# Altium schematic sheet CM5_HighSpeed.SchDoc
size 297 x 209 mm
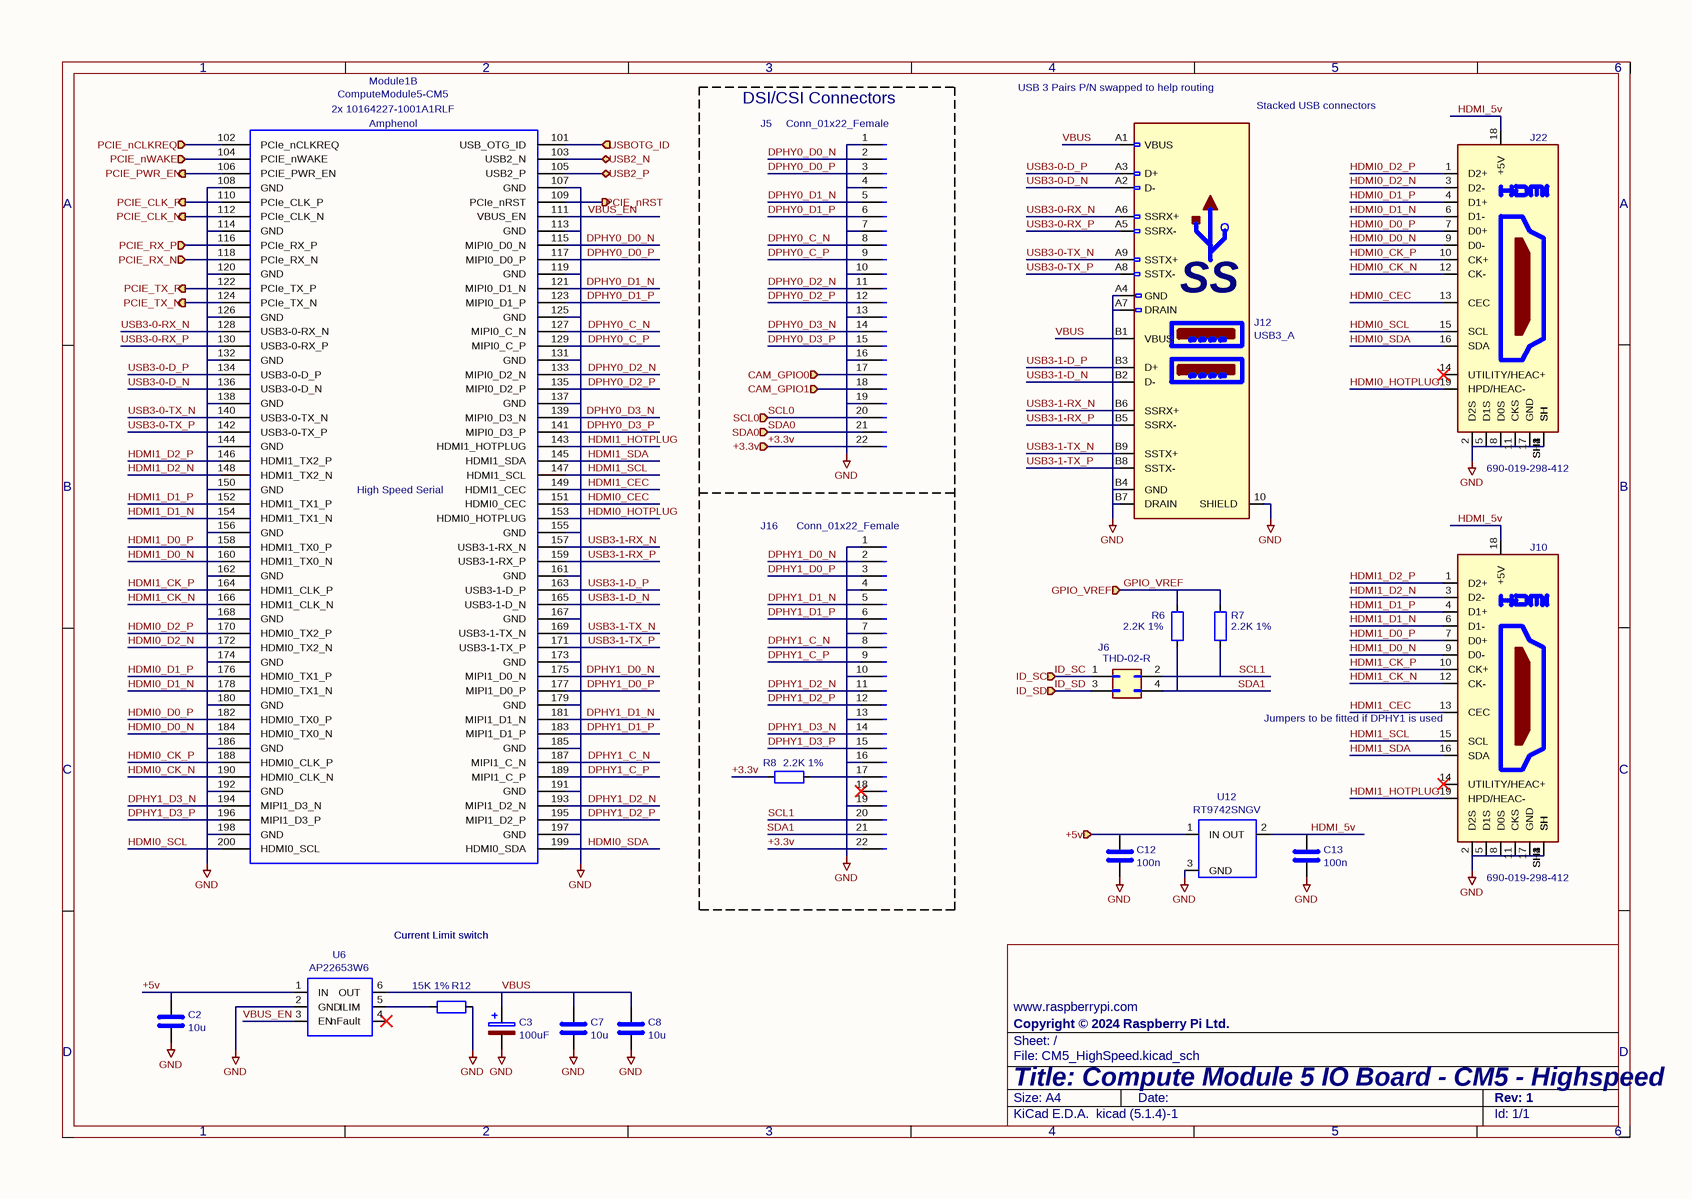
[diagram p0: CM5_HighSpeed.SchDoc]

## Parts
C2  10u  [C_0805_2012Metric]
C3  100uF  [CP_EIA-7343-31_Kemet-D]
C7  10u  [C_0805_2012Metric]
C8  10u  [C_0805_2012Metric]
C12  100n  [C_0402_1005Metric]
C13  100n  [C_0402_1005Metric]
J5  Conn_01x22_Female  [Hirose_FH12-22S-0.5SH_1x22-1MP_P0.50mm_Horizontal]
J6  THD-02-R  [PinHeader_2x02_P2.54mm_Vertical]
J10  690-019-298-412  [EDAC 690-019-298-412]
J12  USB3_A  [MTCONN_UBAF30-D2011]
J16  Conn_01x22_Female  [Hirose_FH12-22S-0.5SH_1x22-1MP_P0.50mm_Horizontal]
J22  690-019-298-412  [EDAC 690-019-298-412]
Module1  Field4: Amphenol  Field5: 2x 10164227-1001A1RLF  [Raspberry-Pi-5-Compute-Module]  (hidden comment: ComputeModule5-CM5)  (part B of 2)
R6  2.2K 1%  [R_0402_1005Metric]
R7  2.2K 1%  [R_0402_1005Metric]
R8  2.2K 1%  [R_0402_1005Metric]
R12  15K 1%  [R_0402_1005Metric]
U6  AP22653W6  [SOT-23-6]
U12  RT9742SNGV  [TSOT-23_HandSoldering]

## Ports
+3.3v (in), +5v (in), CAM_GPIO0 (in), CAM_GPIO1 (in), GPIO_VREF (in), ID_SC (in), ID_SD (in), PCIE_CLK_N (out), PCIE_CLK_P (out), PCIE_nCLKREQ (in), PCIE_nRST (out), PCIE_nWAKE (in), PCIE_PWR_EN (out), PCIE_RX_N (in), PCIE_RX_P (in), PCIE_TX_N (out), PCIE_TX_P (out), SCL0 (in), SDA0 (in), USB2_N (bidir), USB2_P (bidir), USBOTG_ID (in)

## Nets
DPHY1_C_N: C2.2 C3.2 C7.2 C8.2 C12.2 C13.2 J5.1(Pin_1) J5.4(Pin_4) J5.7(Pin_7) J5.10(Pin_10) J5.13(Pin_13) J5.16(Pin_16) J5.19(Pin_19) J10.2(D2S) J10.5(D1S) J10.8(D0S) J10.11(CKS) J10.17(GND) J10.SH1(SH) J10.SH2(SH) J10.SH3(SH) J10.SH4(SH) J12.10(SHIELD) J12.A4(GND) J12.A7(DRAIN) J12.B4(GND) J12.B7(DRAIN) J16.1(Pin_1) J16.4(Pin_4) J16.7(Pin_7) J16.8(Pin_8) J16.10(Pin_10) J16.13(Pin_13) J16.16(Pin_16) J16.19(Pin_19) J22.2(D2S) J22.5(D1S) J22.8(D0S) J22.11(CKS) J22.17(GND) J22.SH1(SH) J22.SH2(SH) J22.SH3(SH) J22.SH4(SH) Module1.107(GND) Module1.108(GND) Module1.113(GND) Module1.114(GND) Module1.119(GND) Module1.120(GND) Module1.125(GND) Module1.126(GND) Module1.131(GND) Module1.132(GND) Module1.137(GND) Module1.138(GND) Module1.144(GND) Module1.150(GND) Module1.155(GND) Module1.156(GND) Module1.161(GND) Module1.162(GND) Module1.167(GND) Module1.168(GND) Module1.173(GND) Module1.174(GND) Module1.179(GND) Module1.180(GND) Module1.185(GND) Module1.186(GND) Module1.187(MIPI1_C_N) Module1.191(GND) Module1.192(GND) Module1.197(GND) Module1.198(GND) R12.2 U6.2(GND) U12.3(GND)  [also labelled GND]
+3.3v: J5.22(Pin_22) J16.22(Pin_22) R8.1 ; port +3.3v
+5v: C12.1 U12.1(IN) ; port +5v
+5v: C2.1 U6.1(IN)  [a separate net that carries the same name]
CAM_GPIO0: J5.17(Pin_17) ; port CAM_GPIO0
CAM_GPIO1: J5.18(Pin_18) ; port CAM_GPIO1
DPHY0_C_N: J5.8(Pin_8) Module1.127(MIPI0_C_N)
DPHY0_C_P: J5.9(Pin_9) Module1.129(MIPI0_C_P)
DPHY0_D0_N: J5.2(Pin_2) Module1.115(MIPI0_D0_N)
DPHY0_D0_P: J5.3(Pin_3) Module1.117(MIPI0_D0_P)
DPHY0_D1_N: J5.5(Pin_5) Module1.121(MIPI0_D1_N)
DPHY0_D1_P: J5.6(Pin_6) Module1.123(MIPI0_D1_P)
DPHY0_D2_N: J5.11(Pin_11) Module1.133(MIPI0_D2_N)
DPHY0_D2_P: J5.12(Pin_12) Module1.135(MIPI0_D2_P)
DPHY0_D3_N: J5.14(Pin_14) Module1.139(MIPI0_D3_N)
DPHY0_D3_P: J5.15(Pin_15) Module1.141(MIPI0_D3_P)
DPHY1_C_P: J16.9(Pin_9) Module1.189(MIPI1_C_P)
DPHY1_D0_N: J16.2(Pin_2) Module1.175(MIPI1_D0_N)
DPHY1_D0_P: J16.3(Pin_3) Module1.177(MIPI1_D0_P)
DPHY1_D1_N: J16.5(Pin_5) Module1.181(MIPI1_D1_N)
DPHY1_D1_P: J16.6(Pin_6) Module1.183(MIPI1_D1_P)
DPHY1_D2_N: J16.11(Pin_11) Module1.193(MIPI1_D2_N)
DPHY1_D2_P: J16.12(Pin_12) Module1.195(MIPI1_D2_P)
DPHY1_D3_N: J16.14(Pin_14) Module1.194(MIPI1_D3_N)
DPHY1_D3_P: J16.15(Pin_15) Module1.196(MIPI1_D3_P)
GPIO_VREF: R6.1 R7.1 ; port GPIO_VREF
HDMI0_CEC: J22.13(CEC) Module1.151(HDMI0_CEC)
HDMI0_CK_N: J22.12(CK-) Module1.190(HDMI0_CLK_N)
HDMI0_CK_P: J22.10(CK+) Module1.188(HDMI0_CLK_P)
HDMI0_D0_N: J22.9(D0-) Module1.184(HDMI0_TX0_N)
HDMI0_D0_P: J22.7(D0+) Module1.182(HDMI0_TX0_P)
HDMI0_D1_N: J22.6(D1-) Module1.178(HDMI0_TX1_N)
HDMI0_D1_P: J22.4(D1+) Module1.176(HDMI0_TX1_P)
HDMI0_D2_N: J22.3(D2-) Module1.172(HDMI0_TX2_N)
HDMI0_D2_P: J22.1(D2+) Module1.170(HDMI0_TX2_P)
HDMI0_HOTPLUG: J22.19(HPD/HEAC-) Module1.153(HDMI0_HOTPLUG)
HDMI0_SCL: J22.15(SCL) Module1.200(HDMI0_SCL)
HDMI0_SDA: J22.16(SDA) Module1.199(HDMI0_SDA)
HDMI1_CEC: J10.13(CEC) Module1.149(HDMI1_CEC)
HDMI1_CK_N: J10.12(CK-) Module1.166(HDMI1_CLK_N)
HDMI1_CK_P: J10.10(CK+) Module1.164(HDMI1_CLK_P)
HDMI1_D0_N: J10.9(D0-) Module1.160(HDMI1_TX0_N)
HDMI1_D0_P: J10.7(D0+) Module1.158(HDMI1_TX0_P)
HDMI1_D1_N: J10.6(D1-) Module1.154(HDMI1_TX1_N)
HDMI1_D1_P: J10.4(D1+) Module1.152(HDMI1_TX1_P)
HDMI1_D2_N: J10.3(D2-) Module1.148(HDMI1_TX2_N)
HDMI1_D2_P: J10.1(D2+) Module1.146(HDMI1_TX2_P)
HDMI1_HOTPLUG: J10.19(HPD/HEAC-) Module1.143(HDMI1_HOTPLUG)
HDMI1_SCL: J10.15(SCL) Module1.147(HDMI1_SCL)
HDMI1_SDA: J10.16(SDA) Module1.145(HDMI1_SDA)
HDMI_5v: C13.1 J10.18(+5V) J22.18(+5V) U12.2(OUT)
ID_SC: J6.1(Pin_1) ; port ID_SC
ID_SD: J6.3(Pin_3) ; port ID_SD
PCIE_CLK_N: Module1.112(PCIe_CLK_N) ; port PCIE_CLK_N
PCIE_CLK_P: Module1.110(PCIe_CLK_P) ; port PCIE_CLK_P
PCIE_nCLKREQ: Module1.102(PCIe_nCLKREQ) ; port PCIE_nCLKREQ
PCIE_nRST: Module1.109(PCIe_nRST) ; port PCIE_nRST
PCIE_nWAKE: Module1.104(PCIE_nWAKE) ; port PCIE_nWAKE
PCIE_PWR_EN: Module1.106(PCIE_PWR_EN) ; port PCIE_PWR_EN
PCIE_RX_N: Module1.118(PCIe_RX_N) ; port PCIE_RX_N
PCIE_RX_P: Module1.116(PCIe_RX_P) ; port PCIE_RX_P
PCIE_TX_N: Module1.124(PCIe_TX_N) ; port PCIE_TX_N
PCIE_TX_P: Module1.122(PCIe_TX_P) ; port PCIE_TX_P
SCL0: J5.20(Pin_20) ; port SCL0
SCL1: J6.2(Pin_2) J16.20(Pin_20) R7.2
SDA0: J5.21(Pin_21) ; port SDA0
SDA1: J6.4(Pin_4) J16.21(Pin_21) R6.2
USB2_N: Module1.103(USB2_N) ; port USB2_N
USB2_P: Module1.105(USB2_P) ; port USB2_P
USB3-0-D_N: J12.A2(D-) Module1.136(USB3-0-D_N)
USB3-0-D_P: J12.A3(D+) Module1.134(USB3-0-D_P)
USB3-0-RX_N: J12.A6(SSRX+) Module1.128(USB3-0-RX_N)
USB3-0-RX_P: J12.A5(SSRX-) Module1.130(USB3-0-RX_P)
USB3-0-TX_N: J12.A9(SSTX+) Module1.140(USB3-0-TX_N)
USB3-0-TX_P: J12.A8(SSTX-) Module1.142(USB3-0-TX_P)
USB3-1-D_N: J12.B2(D-) Module1.165(USB3-1-D_N)
USB3-1-D_P: J12.B3(D+) Module1.163(USB3-1-D_P)
USB3-1-RX_N: J12.B6(SSRX+) Module1.157(USB3-1-RX_N)
USB3-1-RX_P: J12.B5(SSRX-) Module1.159(USB3-1-RX_P)
USB3-1-TX_N: J12.B9(SSTX+) Module1.169(USB3-1-TX_N)
USB3-1-TX_P: J12.B8(SSTX-) Module1.171(USB3-1-TX_P)
USBOTG_ID: Module1.101(USB_OTG_ID) ; port USBOTG_ID
VBUS: C3.1 C7.1 C8.1 J12.A1(VBUS) J12.B1(VBUS) U6.6(OUT)
VBUS_EN: Module1.111(VBUS_EN) U6.3(EN)
NetJ16_17: J16.17(Pin_17) R8.2
NetR12_1: R12.1 U6.5(ILIM)

Not connected (* = marked no-connect by the designer): J10 14(UTILITY/HEAC+)*; J16 18(Pin_18)*; J22 14(UTILITY/HEAC+)*; U6 4(nFault)*

## Notes on the sheet
- (near J5) DSI/CSI Connectors
- (near J12) USB 3 Pairs P/N swapped to help routing
- (near J12) Stacked USB connectors
- (near J10) Jumpers to be fitted if DPHY1 is used
- Current Limit switch
- 1
- 2
- 3
- 4
- 5
- 6
- A
- B
- C
- www.raspberrypi.com <http://www.raspberrypi.com>
- D
- Title: Compute Module 5 IO Board - CM5 - Highspeed
- File: CM5_HighSpeed.kicad_sch
- Sheet: /
- Copyright © 2024 Raspberry Pi Ltd.
- KiCad E.D.A.  kicad (5.1.4)-1
- Size: A4
- Date:
- Rev: 1
- Id: 1/1
- (in symbol ComputeModule5-CM5, part B) High Speed Serial
- (in symbol USB3_A) SS

## Library data of the parts
C2 C7 C8 = C: Part Description: 10uF 10% 10V Ceramic Capacitor X7R 0805 (2012 Metric); Field5: 490-14381-1-ND; Field4: Digikey; Field6: GRM21BR71A106KA73L; Field7: Murata; Field8: 111893011; Value: 10u; Footprint: Capacitor_SMD:C_0805_2012Metric
C3 = C_Polarized: Part Description: Capacitor, SP-Cap, 100u, 6.3V, 15mR ESR; Field4: Mouser; Field5: 667-EEF-CX0J101R; Field7: Panasonic; Value: 100uF; Footprint: Capacitor_Tantalum_SMD:CP_EIA-7343-31_Kemet-D
C12 C13 = C: Part Description: 0.1uF 10% 16V Ceramic Capacitor X7R 0402 (1005 Metric); Field4: Farnell; Field5: 2611911; Field6: RM EMK105 B7104KV-F; Field7: TAIYO YUDEN EUROPE GMBH; Field8: 110091611; Value: 100n; Footprint: Capacitor_SMD:C_0402_1005Metric
J5 J16 = Conn_01x22_Socket: Part Description: 22 Position FFC, FPC Connector Contacts, Bottom 0.020" (0.50mm) Surface Mount, Right Angle; Field4: Mouser; Field5: 798-FH12-22S-0.5SH55; Field6: FH12-22S-0.5SH55; Field7: Hirose; Value: Conn_01x22_Female; Footprint: CM5IO:Hirose_FH12-22S-0.5SH_1x22-1MP_P0.50mm_Horizontal
J6 = Conn_02x02_Odd_Even: Field4: Toby; Field6: 151-604-425-761; Field7: EDAC; Field8: UCON00791; Field5: THD-02-R; Part Description: PinHeader_2x02_P2.54mm_Vertical; Value: THD-02-R; Footprint: Connector_PinHeader_2.54mm:PinHeader_2x02_P2.54mm_Vertical
J10 J22 = HDMI_A_1.4: Part Description: HDMI Connector, Right Angle, 19 Contacts, Receptacle, Surface Mount, Surface Mount Right Angle; Field4: Farnell; Field5: 2614936; Field7: EDAC; Field8: UCON00802; Field6: 690-019-298-412; Value: 690-019-298-412; Footprint: CM5IO:EDAC 690-019-298-412
J12 = USB3_A: Part Description: Dual USB 3 connector; Field6: UBAF30-D2011; Field7: Mtconn; Field5: UBAF30-D2011; Value: USB3_A; Footprint: CM5IO:MTCONN_UBAF30-D2011
Module1 = ComputeModule5-CM5: Part Description: 100 Position Connector Receptacle, Center Strip Contacts Surface Mount Gold; Description: RaspberryPi Compute module 5; Field7: Hirose; Field6: 2x 10164227-1001A1RLF; Value: ComputeModule5-CM5; Footprint: CM5IO:Raspberry-Pi-5-Compute-Module
R6-R8 = R: Part Description: Resistor 2.2K M1005 1% 63mW; Field4: Farnell; Value: 2.2K 1%; Footprint: Resistor_SMD:R_0402_1005Metric
R12 = R: Part Description: Resistor 15K M1005 1% 63mW; Field4: Farnell; Field5: 9239375; Field6: MCR01MZPF1502; Field7: Rohm; Field8: 120891581; Value: 15K 1%; Footprint: Resistor_SMD:R_0402_1005Metric
U6 = AP2553W6: Part Description: Power Switch/Driver 1:1 P-Channel 2.1A SOT-23-6; Field4: Digikey; Field5: 31-AP22653W6-7CT-ND; Field7: Diodes; Field6: AP22653W6; Value: AP22653W6; Footprint: Package_TO_SOT_SMD:SOT-23-6
U12 = RT9742SNGV: Part Description: Power Switch/Driver 1:1 N-Channel 500mA SOT-23-3; Field4: Farnell; Field5: 2575555; Field7: RichTek; Field8: USWI00155; Field6: RT9742SNGV; Value: RT9742SNGV; Footprint: Package_TO_SOT_SMD:TSOT-23_HandSoldering